# Altium schematic sheet clock.SchDoc
size A4
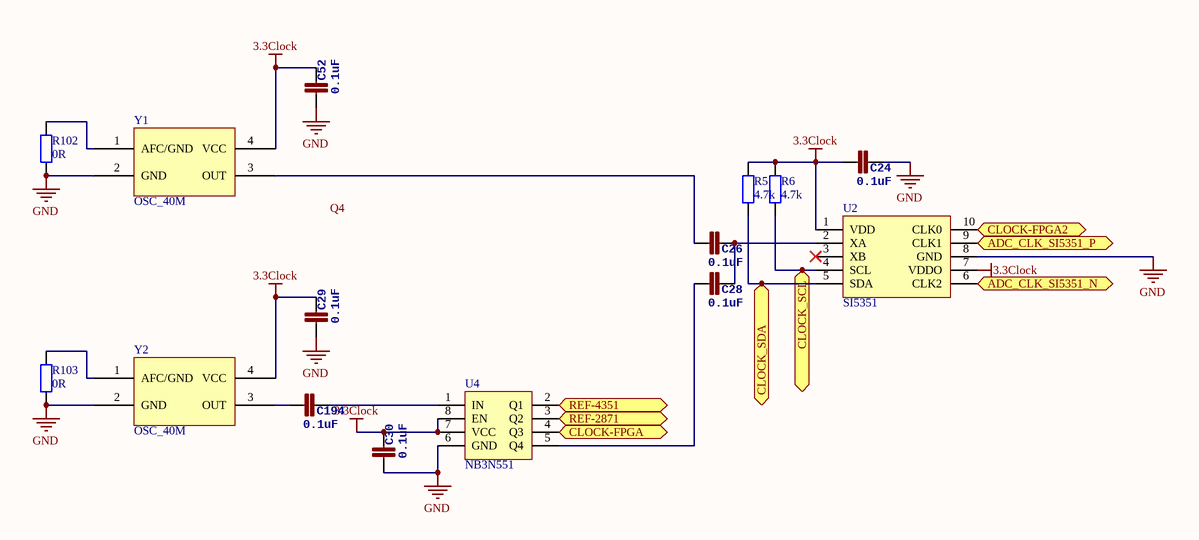
[diagram p0: clock.SchDoc]

## Parts
C24  0.1uF  [0402]
C26  0.1uF  [0402]
C28  0.1uF  [0402]
C29  0.1uF  [0402]
C30  0.1uF  [0402]
C52  0.1uF  [0402]
C194  0.1uF  [0402]
R5  4.7k  [0402]
R6  4.7k  [0402]
R102  0R  [0402]
R103  0R  [0402]
U2  SI5351  [MSOP10/VSSOP10]
U4  NB3N551  [SO8]
Y1  OSC_40M  [TXC_7Q]
Y2  OSC_40M  [TXC_7Q]

## Ports
ADC_CLK_SI5351_N, ADC_CLK_SI5351_P, CLOCK-FPGA, CLOCK-FPGA2, CLOCK_SCL, CLOCK_SDA, REF-2871, REF-4351

## Nets
3.3Clock: C24.1 C29.2 C30.2 C52.2 R5.1 R6.1 U2.1(VDD) U2.7(VDDO) U4.7(VCC) U4.8(EN) Y1.4(VCC) Y2.4(VCC)
GND: C24.2 C29.1 C30.1 C52.1 R102.2 R103.2 U2.8(GND) U4.6(GND) Y1.2(GND) Y2.2(GND)
ADC_CLK_SI5351_N: U2.6(CLK2) ; port ADC_CLK_SI5351_N
ADC_CLK_SI5351_P: U2.9(CLK1) ; port ADC_CLK_SI5351_P
CLOCK-FPGA: U4.4(Q3) ; port CLOCK-FPGA
CLOCK-FPGA2: U2.10(CLK0) ; port CLOCK-FPGA2
CLOCK_SCL: R6.2 U2.4(SCL) ; port CLOCK_SCL
CLOCK_SDA: R5.2 U2.5(SDA) ; port CLOCK_SDA
REF-2871: U4.3(Q2) ; port REF-2871
REF-4351: U4.2(Q1) ; port REF-4351
NetC26_1: C26.1 Y1.3(OUT)
NetC26_2: C26.2 C28.2 U2.2(XA)
NetC28_1: C28.1 U4.5(Q4)
NetC194_1: C194.1 Y2.3(OUT)
NetC194_2: C194.2 U4.1(IN)
NetR102_1: R102.1 Y1.1(AFC/GND)
NetR103_1: R103.1 Y2.1(AFC/GND)

Not connected (* = marked no-connect by the designer): U2 3(XB)*

## Notes on the sheet
- Labels drawn without touching a wire or pin: Q4

## Library data of the parts
C24 C26 C28-C30 C52 C194 = CAP0402-CAP: <b>Capacitor</b> / Standard 0603 ceramic capacitor, and 0.1" leaded capacitor.; PARTNO: CC0402ZRY5V7BB104
R5 R6 R102 R103 = Res2: Resistor; Published: 8-Jun-2000; LatestRevisionDate: 17-Jul-2002; LatestRevisionNote: Re-released for DXP Platform.; PackageReference: AXIAL-0.4; Publisher: Altium Limited; PackageDescription: Axial Device, Thru-Hole; 2 Leads; 0.4 in Pin Spacing